# EAGLE design motor_controller_schV2 (EAGLE 7.7.0)
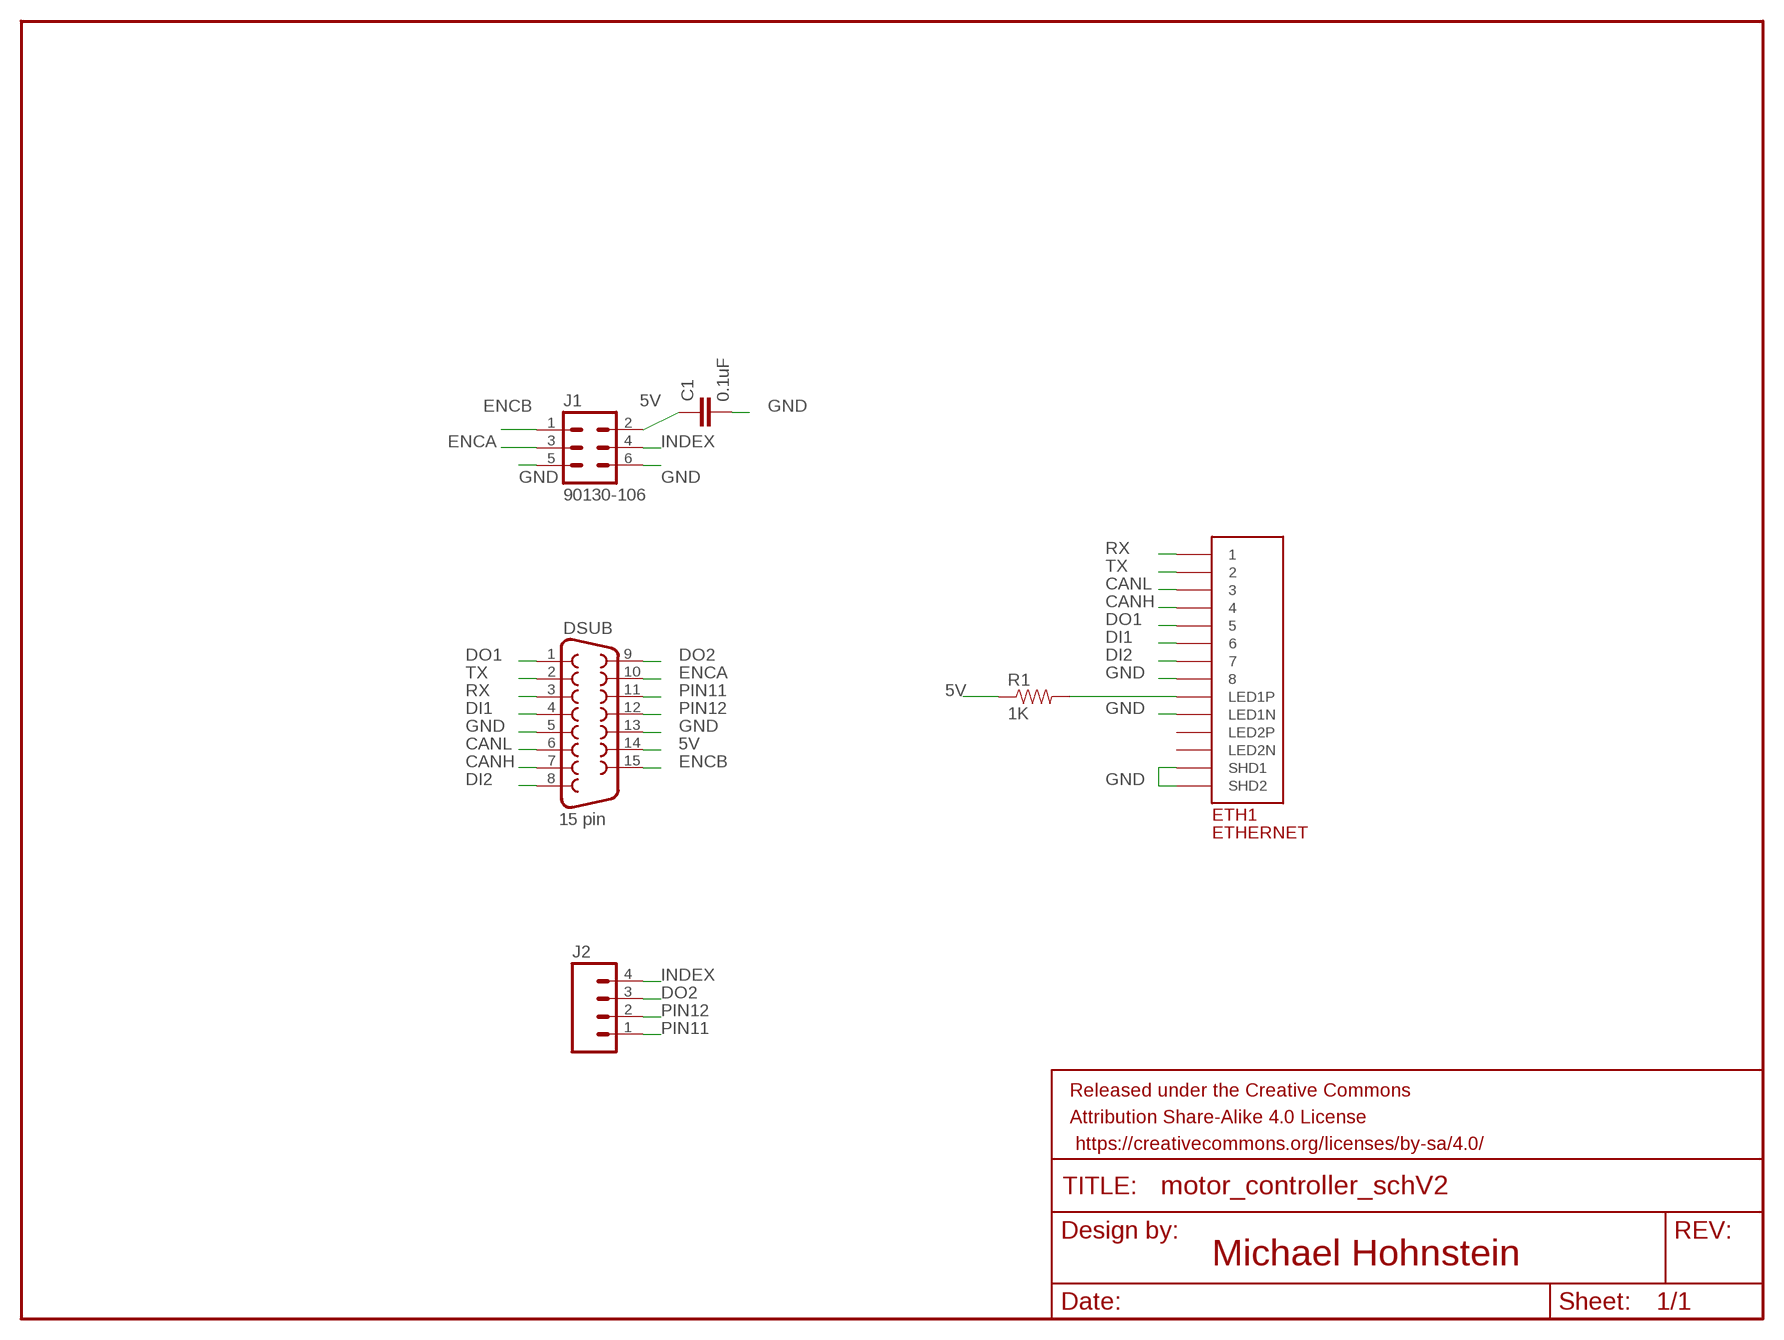
[diagram p0: schematic, sheet 1]

## Parts
C1  0.1uF  0.1UF-25V(+80/-20%)(0603)  [0603-CAP]
DSUB  15 pin  F15HP  [F15HP]
ETH1  ETHERNET  [A122645-ND]
FRAME1  FRAME-LETTER  [CREATIVE_COMMONS]
J1  90130-106  [90130-1?06]
J2  M04PTH  [1X04]
R1  1K  1KOHM-1/10W-1%(0603)  [0603-RES]

## Nets
5V: C1.1 DSUB.14 J1.2 R1.1
CANH: DSUB.7 ETH1.P$4
CANL: DSUB.6 ETH1.P$3
DI1: DSUB.4 ETH1.P$6
DI2: DSUB.8 ETH1.P$7
DO1: DSUB.1 ETH1.P$5
DO2: DSUB.9 J2.3
ENCA: DSUB.10 J1.3
ENCB: DSUB.15 J1.1
GND: C1.2 DSUB.5 DSUB.13 ETH1.P$8 ETH1.P$9(LED1N) ETH1.P$13(SHD1) ETH1.P$14(SHD2) J1.5 J1.6
INDEX: J1.4 J2.4
N$1: ETH1.P$10(LED1P) R1.2
PIN11: DSUB.11 J2.1
PIN12: DSUB.12 J2.2
RX: DSUB.3 ETH1.P$1
TX: DSUB.2 ETH1.P$2
Unconnected: ETH1.P$11(LED2N) ETH1.P$12(LED2P)

## Notes on the sheet
- Michael Hohnstein

## Library data of the parts
C1 = SparkFun-Capacitors:0.1UF-25V(+80/-20%)(0603): CAP-00810 Ceramic Standard decoupling cap; PROD_ID: CAP-00810
DSUB = con-subd:F15: SUB-D; OC_FARNELL: unknown; OC_NEWARK: unknown
ETH1 = ETHERNET:ETHERNET: Ethernet port with 2 leds. digikey number A122645-ND
FRAME1 = SparkFun-Aesthetics:FRAME-LETTER: Schematic Frame Standard 8.5x11 US Letter frame
J1 = con-molex-c-grid:90130-1?06: C-Grid III
J2 = SparkFun-Connectors:M04: Header 4 Standard 4-pin 0.1" header. Use with straight break away headers (SKU : PRT-00116), right angle break away headers (PRT-00553), swiss pins (PRT-00743), machine pins (PRT-00117), and female headers (PRT-00115). Molex polarized connector foot print use with SKU : PRT-08231 with associated crimp pins and housings. 1MM SMD Version SKU: PRT-10208; PROD_ID: CONN-09696
R1 = SparkFun-Resistors:1KOHM-1/10W-1%(0603): RES-07856; PROD_ID: RES-07856

## Board
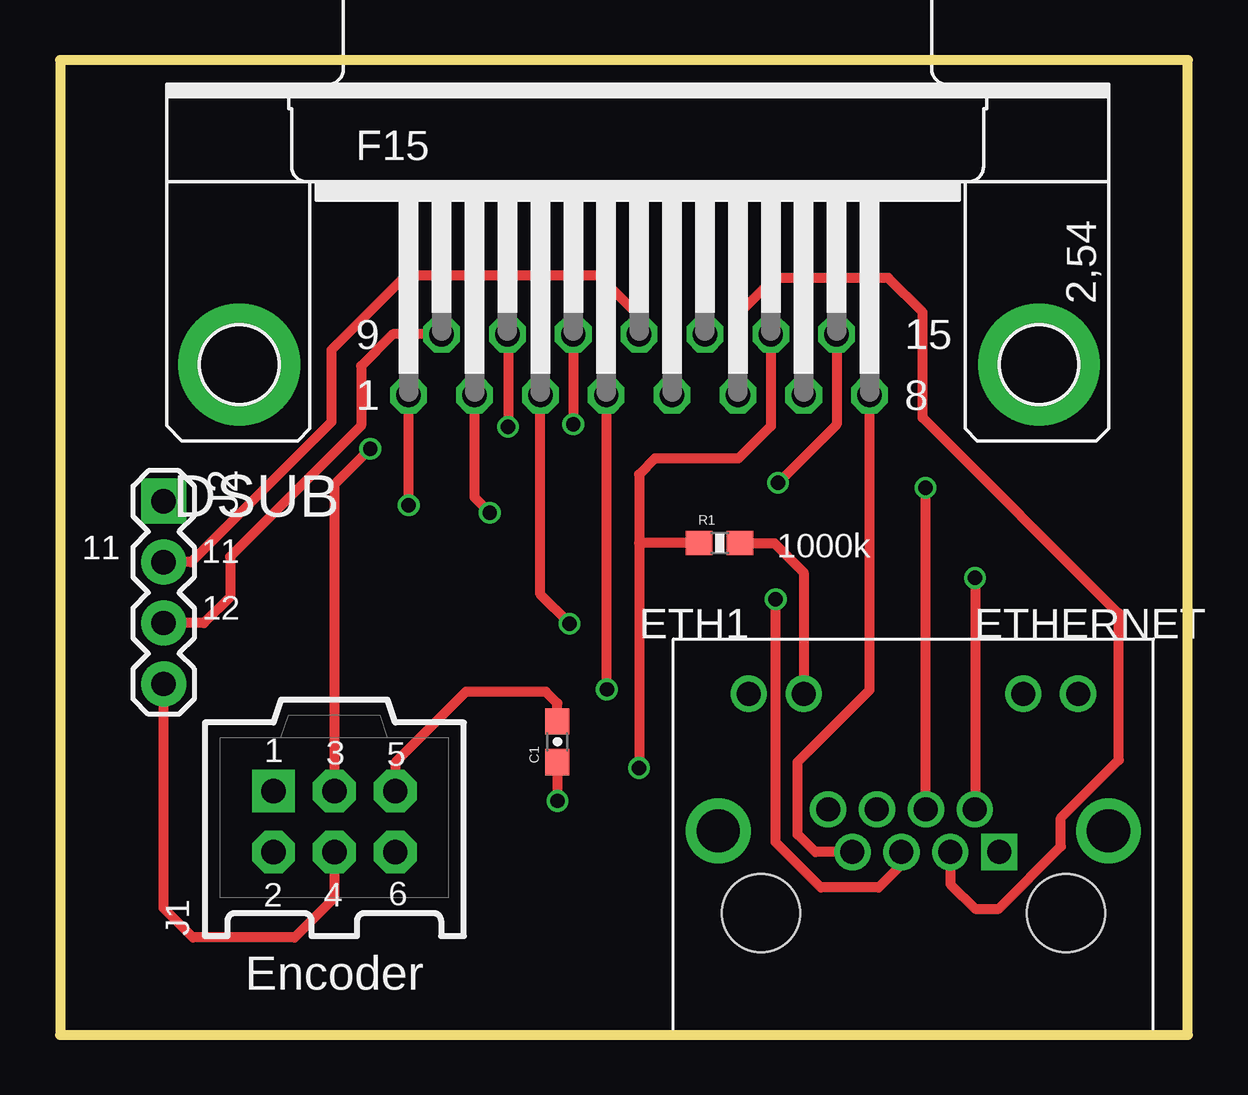
[diagram p1: board, top side]
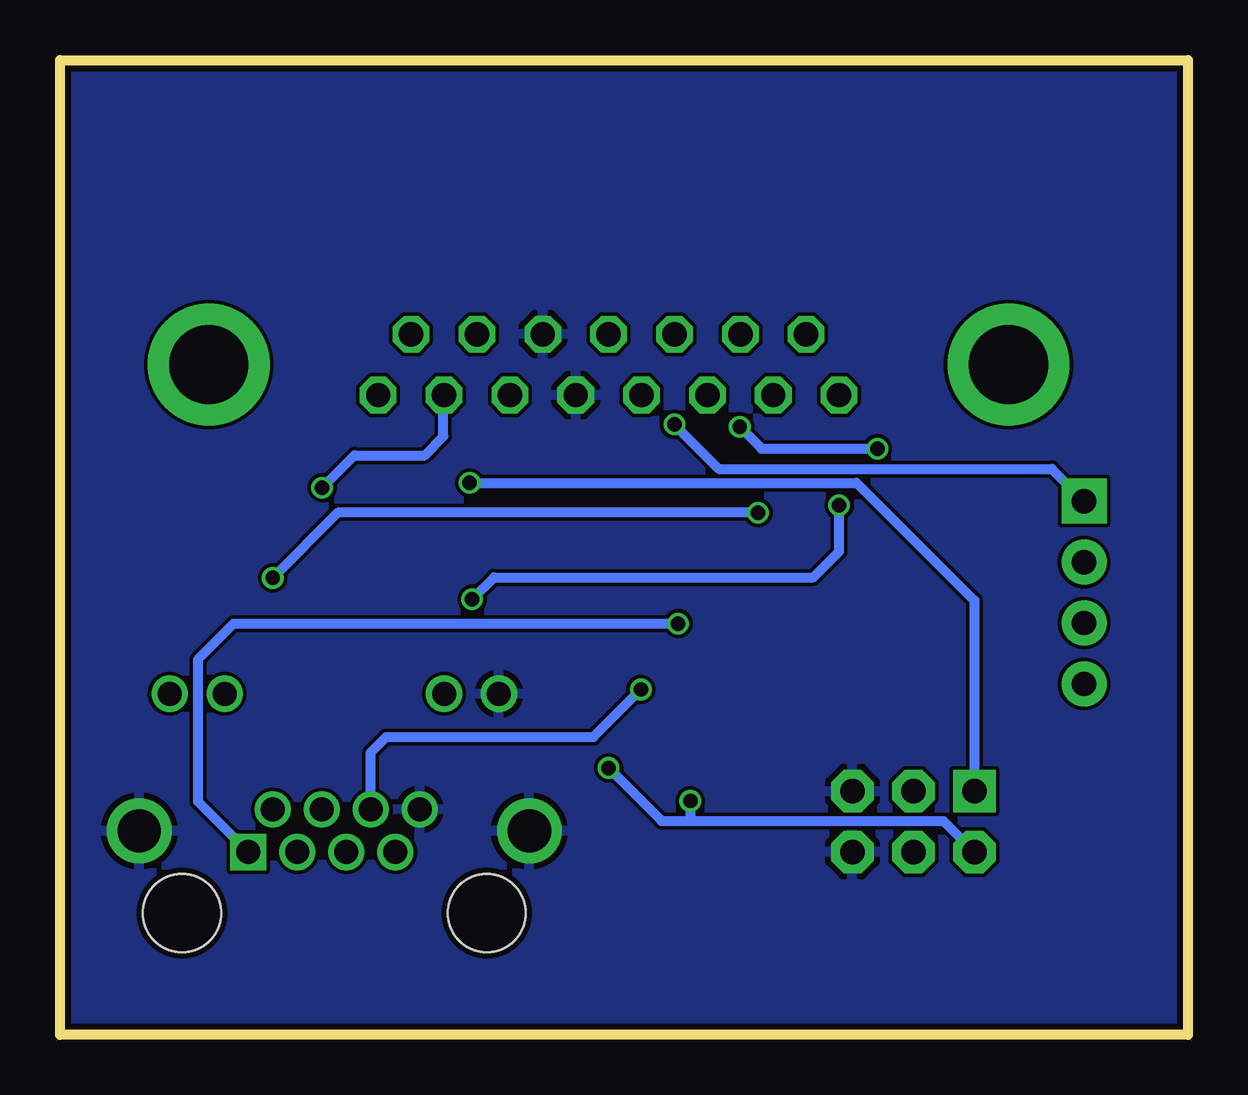
[diagram p2: board, bottom side, seen from below]

Size 46.99 x 40.64 mm. Coordinates in mm from the lower left corner, seen from the top.
Outline: 0,0 46.99,0 46.99,40.64 0,40.64 0,0
Copper layers (1*16): Top 0.035mm / dielectric 1.5mm / Bottom 0.035mm
Design rules "SeeedStudio_2layer_DRU_no_angle_20140221": minimum track width 6mil, minimum drill 12mil, track to track 6mil, track to pad 6mil, pad to pad 6mil, via to via 6mil, smd to smd 0mil, copper to edge 10mil, drill to drill 10mil, minimum pad ring 10mil, minimum via ring 6mil, stop-mask expansion 2mil, vias tented up to drill 100mil, thermal gap 10mil

### Footprints (pad centres in the part's own frame; a part is rotated, then mirrored left to right if it is on the bottom)
0603-CAP = smd 1.1 x 1: 1 -0.85,0; 2 0.85,0
F15HP = drill 1.016 octagon: 1 -9.601,-1.27; 2 -6.858,-1.27; 3 -4.115,-1.27; 4 -1.372,-1.27; 5 1.372,-1.27; 6 4.115,-1.27; 7 6.858,-1.27; 8 9.601,-1.27; 9 -8.23,1.27; 10 -5.486,1.27; 11 -2.743,1.27; 12 0,1.27; 13 2.743,1.27; 14 5.486,1.27; 15 8.23,1.27 | drill 3.302 pad 5.08: G1 -16.662,0; G2 16.662,0
A122645-ND = drill 1 square: P$1 3.58,2.54 | drill 1: P$2 2.56,4.32; P$3 1.54,2.54; P$4 0.52,4.32; P$5 -0.5,2.54; P$6 -1.52,4.32; P$7 -2.54,2.54; P$8 -3.56,4.32; P$9 -6.86,9.14; P$10 -4.57,9.14; P$11 4.57,9.14; P$12 6.86,9.14 | drill 1.8: P$13 -8.13,3.43; P$14 8.13,3.43 | hole 3.25: -6.35,0; 6.35,0
90130-1?06 = drill 1.016 pad 1.778 square: 1 -2.54,1.27 | drill 1.016 pad 1.778 octagon: 2 -2.54,-1.27; 3 0,1.27; 4 0,-1.27; 5 2.54,1.27; 6 2.54,-1.27
1X04 = drill 1.016 pad 1.88 square: 1 0,0 | drill 1.016 pad 1.88: 2 2.54,0; 3 5.08,0; 4 7.62,0
0603-RES = smd 1.1 x 1: 1 -0.85,0; 2 0.85,0

### Placement (x,y rotation side)
C1  20.73,12.22 90 top
DSUB  24.13,27.94 0 top
ETH1  35.56,5.08 0 top
FRAME1  -101.6,46.99 0 top  (outside the outline)
J1  11.43,8.89 0 top
J2  4.32,22.25 270 top
R1  27.48,20.5 0 top

### Tracks (layer width: path | path; a pad name or v marks a point on that pad's centre or on a via)
5V  (via drill 0.6)
  Top 0.406: DSUB.14 29.62,25.38 28.27,24.03 24.79,24.03 24.13,23.37 24.13,20.5 | 24.13,20.5 v24.13,11.12 | C1.1 v20.73,9.75 | R1.1 24.13,20.5
  Bottom 0.406: v24.13,11.12 21.92,8.91 20.73,8.91 | 20.73,8.91 10.19,8.91 J1.2 | v20.73,9.75 20.73,8.91
CANH  (via drill 0.6)
  Top 0.406: ETH1.P$4 36.08,22.8 v36.07,22.81
  Bottom 0.406: v36.07,22.81 34.72,24.16 31.8,24.16 31.01,24.94 31.01,26.64 DSUB.7
CANL
  Top 0.406: ETH1.P$3 37.1,6.28 38.12,5.26 39.12,5.26 41.71,7.85 41.71,9.04 44.12,11.46 44.12,17.55 | 44.12,17.58 44.12,17.55 | 44.12,17.55 35.94,25.73 35.94,30.12 34.52,31.55 29.77,31.55 28.27,30.05 28.27,26.7 DSUB.6
DI1  (via drill 0.6)
  Top 0.406: v22.78,14.4 22.78,26.64 DSUB.4
  Bottom 0.406: ETH1.P$6 34.04,11.78 33.4,12.42 24.77,12.42 v22.78,14.4
DI2
  Top 0.406: ETH1.P$7 31.47,7.62 30.73,8.36 30.73,11.38 33.73,14.38 DSUB.8
DO1  (via drill 0.6)
  Top 0.406: v14.53,22.07 DSUB.1 | ETH1.P$5 35.06,7.09 34.11,6.15 31.7,6.15 29.82,8.03 v29.82,18.16
  Bottom 0.406: v14.53,22.07 14.53,20.14 15.6,19.07 28.91,19.07 v29.82,18.16
DO2
  Top 0.406: DSUB.9 13.87,29.21 12.55,27.89 12.55,25.4 7.09,19.94 7.09,18.26 5.99,17.17 J2.3
ENCA  (via drill 0.6)
  Top 0.406: DSUB.10 18.67,29.18 v18.67,25.35 | v12.93,24.43 11.43,22.94 11.43,15.34 11.43,15.29 J1.3
  Bottom 0.406: v18.67,25.35 17.75,24.43 v12.93,24.43
ENCB  (via drill 0.6)
  Top 0.406: DSUB.15 32.36,25.45 v29.92,23.01
  Bottom 0.406: v29.92,23.01 13.79,23.01 8.89,18.11 J1.1
GND
  Top 0.406: C1.2 20.73,13.82 20.24,14.3 16.92,14.3 13.97,11.35 J1.5
  pour Bottom: 0.03,-0.03 47.02,-0.03 47.02,40.54 0.03,40.54
INDEX
  Top 0.406: J1.4 11.43,5.71 9.78,4.06 5.54,4.06 4.32,5.28 J2.4
N$1
  Top 0.406: R1.2 29.77,20.5 30.99,19.28 ETH1.P$10
PIN11  (via drill 0.6)
  Top 0.406: DSUB.11 v21.39,25.45
  Bottom 0.406: v21.39,25.45 19.53,23.6 5.66,23.6 J2.1
PIN12
  Top 0.406: DSUB.12 24.13,29.97 22.45,31.65 14.4,31.65 11.3,28.55 11.3,25.55 5.46,19.71 J2.2
RX  (via drill 0.6)
  Top 0.406: v21.23,17.14 20.02,18.36 DSUB.3
  Bottom 0.406: v21.23,17.14 39.75,17.14 41.25,15.65 41.25,9.73 ETH1.P$1
TX  (via drill 0.6)
  Top 0.406: DSUB.2 17.27,22.4 v17.91,21.77 | v38.12,19.05 ETH1.P$2
  Bottom 0.406: v17.91,21.77 35.41,21.77 v38.12,19.05

### Text on the board
tPlace: 11 | 11 | 1000k | 12 | 1 | 3 | 5 | 2 | 4 | 6
_tsilk: Encoder